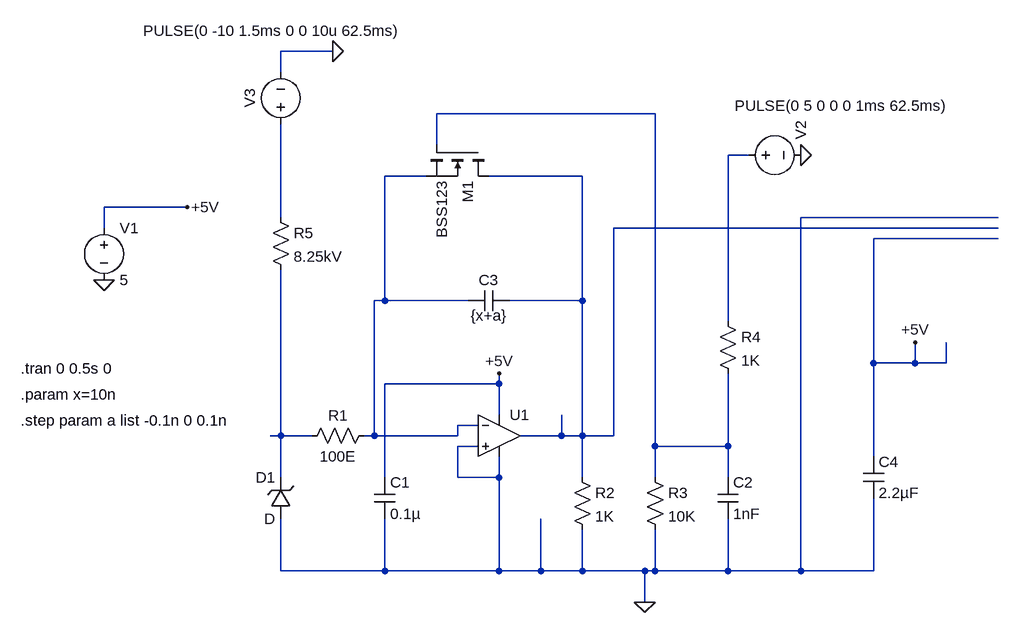
[diagram p0: schematic PM-PCB.asc]
PM-PCB.asc, the LTspice schematic file:
Version 4.1
SHEET 1 1936 680
WIRE 128 -496 48 -496
WIRE 48 -464 48 -496
WIRE 624 -400 288 -400
WIRE 288 -352 288 -400
WIRE 768 -336 736 -336
WIRE 272 -304 208 -304
WIRE 512 -304 368 -304
WIRE -96 -256 -224 -256
WIRE 48 -240 48 -384
WIRE 1152 -240 848 -240
WIRE -224 -224 -224 -256
WIRE 1152 -224 560 -224
WIRE 1152 -208 960 -208
WIRE 208 -112 208 -304
WIRE 208 -112 192 -112
WIRE 336 -112 208 -112
WIRE 512 -112 512 -304
WIRE 512 -112 400 -112
WIRE 736 -80 736 -336
WIRE 960 -16 960 -208
WIRE 1024 -16 1024 -48
WIRE 1024 -16 960 -16
WIRE 1072 -16 1072 -48
WIRE 1072 -16 1024 -16
WIRE 384 16 384 0
WIRE 384 16 208 16
WIRE 384 64 384 16
WIRE 352 80 320 80
WIRE 48 96 48 -160
WIRE 48 96 32 96
WIRE 96 96 48 96
WIRE 192 96 192 -112
WIRE 192 96 176 96
WIRE 320 96 320 80
WIRE 320 96 192 96
WIRE 480 96 480 64
WIRE 480 96 416 96
WIRE 512 96 512 -112
WIRE 512 96 480 96
WIRE 560 96 560 -224
WIRE 560 96 512 96
WIRE 352 112 320 112
WIRE 624 112 624 -400
WIRE 736 112 736 0
WIRE 736 112 624 112
WIRE 960 128 960 -16
WIRE 48 160 48 96
WIRE 208 160 208 16
WIRE 320 160 320 112
WIRE 384 160 384 128
WIRE 384 160 320 160
WIRE 512 160 512 96
WIRE 624 160 624 112
WIRE 736 160 736 112
WIRE 48 304 48 224
WIRE 208 304 208 224
WIRE 208 304 48 304
WIRE 384 304 384 160
WIRE 384 304 208 304
WIRE 448 304 448 224
WIRE 448 304 384 304
WIRE 512 304 512 240
WIRE 512 304 448 304
WIRE 608 304 512 304
WIRE 624 304 624 240
WIRE 624 304 608 304
WIRE 736 304 736 224
WIRE 736 304 624 304
WIRE 848 304 848 -240
WIRE 848 304 736 304
WIRE 960 304 960 192
WIRE 960 304 848 304
WIRE 608 352 608 304
FLAG -224 -144 0
FLAG -96 -256 +5V
FLAG 384 0 +5V
FLAG 608 352 0
FLAG 1024 -48 +5V
FLAG 128 -496 0
FLAG 848 -336 0
SYMBOL res 192 80 R90
WINDOW 0 0 56 VBottom 2
WINDOW 3 32 56 VTop 2
SYMATTR InstName R1
SYMATTR Value 100E
SYMATTR SpiceLine tol=1 pwr=100mW
SYMBOL cap 192 160 R0
SYMATTR InstName C1
SYMATTR Value 0.1µ
SYMATTR SpiceLine V=1.6kV
SYMBOL cap 400 -128 R90
WINDOW 0 0 32 VBottom 2
WINDOW 3 54 32 VBottom 2
SYMATTR InstName C3
SYMATTR Value {x+a}
SYMBOL OpAmps\\UniversalOpAmp 384 96 R0
SYMATTR InstName U1
SYMBOL zener 64 224 R180
WINDOW 0 24 64 Left 2
WINDOW 3 24 0 Left 2
SYMATTR InstName D1
SYMBOL res 496 144 R0
SYMATTR InstName R2
SYMATTR Value 1K
SYMBOL res 608 144 R0
SYMATTR InstName R3
SYMATTR Value 10K
SYMBOL cap 720 160 R0
SYMATTR InstName C2
SYMATTR Value 1nF
SYMBOL cap 944 128 R0
SYMATTR InstName C4
SYMATTR Value 2.2µF
SYMBOL res 720 -96 R0
SYMATTR InstName R4
SYMATTR Value 1K
SYMBOL nmos 368 -352 R90
SYMATTR InstName M1
SYMATTR Value BSS123
SYMBOL voltage -224 -240 R0
WINDOW 123 0 0 Left 0
WINDOW 39 0 0 Left 0
SYMATTR InstName V1
SYMATTR Value 5
SYMBOL res 32 -256 R0
SYMATTR InstName R5
SYMATTR Value 8.25kV
SYMBOL voltage 752 -336 R270
WINDOW 0 24 96 Left 2
WINDOW 3 76 -6 VRight 2
WINDOW 123 0 0 Left 0
WINDOW 39 0 0 Left 0
SYMATTR InstName V2
SYMATTR Value PULSE(0 5 0 0 0 1ms 62.5ms)
SYMBOL voltage 48 -368 R180
WINDOW 0 32 56 VTop 2
WINDOW 3 13 175 Bottom 2
WINDOW 123 0 0 Left 0
WINDOW 39 0 0 Left 0
SYMATTR InstName V3
SYMATTR Value PULSE(0 -10 1.5ms 0 0 10u 62.5ms)
TEXT -352 -8 Left 2 !.tran 0 0.5s 0
TEXT -352 32 Left 2 !.param x=10n
TEXT -352 72 Left 2 !.step param a list -0.1n 0 0.1n

The netlist it stands for:
* PM-PCB.asc
R1 N003 N006 100E tol=1 pwr=100mW
C1 +5V 0 0.1µ V=1.6kV
C3 N004 N003 {x+a}
X§U1 0 N003 +5V 0 N004 level1 Avol=1Meg GBW=10Meg Vos=0 En=0 Enk=0 In=0 Ink=0 Rin=500Meg  ; pins In+ In- V+ V- OUT
D1 0 N006 D
R2 N004 0 1K
R3 N001 0 10K
C2 N001 0 1nF
C4 +5V 0 2.2µF
R4 N002 N001 1K
M1 N004 N001 N003 N003 BSS123
V1 +5V 0 5
R5 N005 N006 8.25kV
V2 N002 0 PULSE(0 5 0 0 0 1ms 62.5ms)
V3 N005 0 PULSE(0 -10 1.5ms 0 0 10u 62.5ms)
.model D D
.lib standard.dio
.model NMOS NMOS
.model PMOS PMOS
.lib standard.mos
.tran 0 0.5s 0
.param x=10n
.step param a list -0.1n 0 0.1n
.lib UniversalOpAmp1.lib
.backanno
.end